# Altium schematic sheet limit_switches.SchDoc: Limit Switches
size A4; Organization: Badgerloop; Address1: 133 Engineering Research; Address2: Building; Address3: Madison, WI 53715; SheetNumber: 19
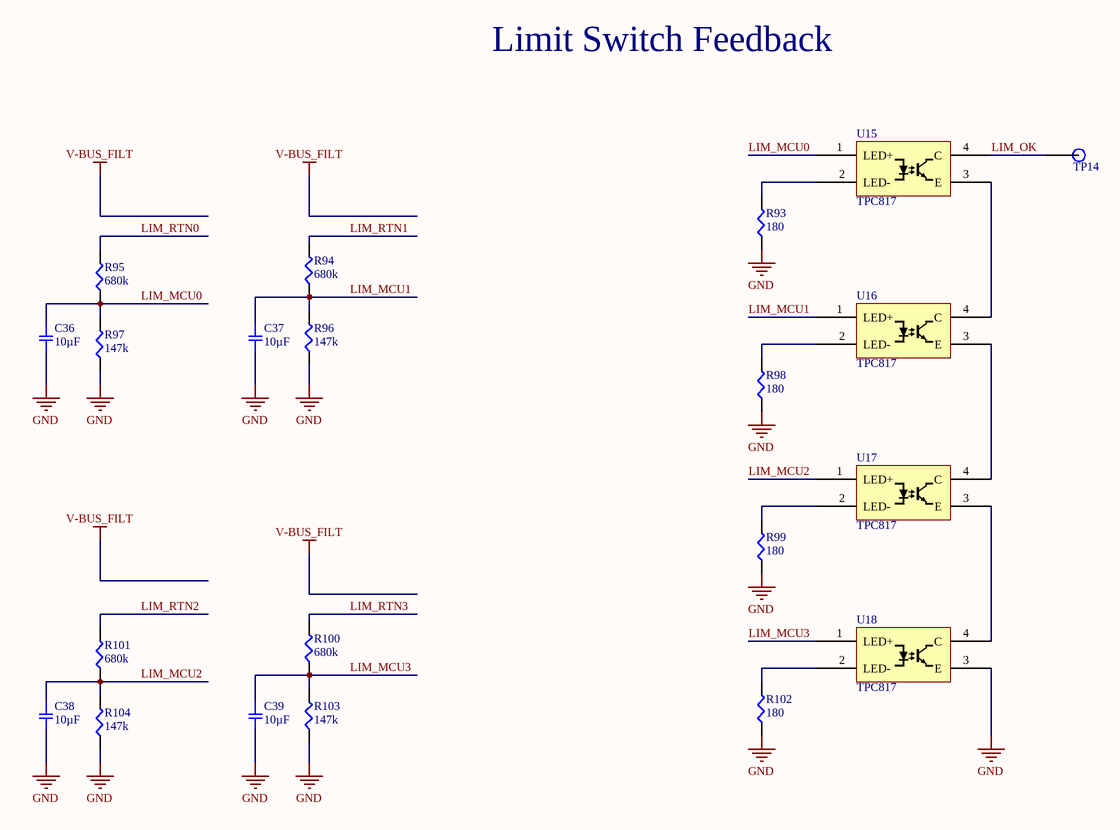
[diagram p0: limit_switches.SchDoc]

## Parts
C36  10µF  [SMD-0805C]
C37  10µF  [SMD-0805C]
C38  10µF  [SMD-0805C]
C39  10µF  [SMD-0805C]
R93  180  [SMD-0805-RES]
R94  680k  [SMD-0805-RES]
R95  680k  [SMD-0805-RES]
R96  147k  [SMD-0805-RES]
R97  147k  [SMD-0805-RES]
R98  180  [SMD-0805-RES]
R99  180  [SMD-0805-RES]
R100  680k  [SMD-0805-RES]
R101  680k  [SMD-0805-RES]
R102  180  [SMD-0805-RES]
R103  147k  [SMD-0805-RES]
R104  147k  [SMD-0805-RES]
TP14  TP  [Test Point]  (value not drawn)
U15  TPC817  [SOT200P1005X328-5N]
U16  TPC817  [SOT200P1005X328-5N]
U17  TPC817  [SOT200P1005X328-5N]
U18  TPC817  [SOT200P1005X328-5N]

## Nets
GND: C36.2 C37.2 C38.2 C39.2 R93.1 R96.1 R97.1 R98.1 R99.1 R102.1 R103.1 R104.1 U18.3(E)
LIM_MCU0: C36.1 R95.1 R97.2 U15.1(LED+)
LIM_MCU1: C37.1 R94.1 R96.2 U16.1(LED+)
LIM_MCU2: C38.1 R101.1 R104.2 U17.1(LED+)
LIM_MCU3: C39.1 R100.1 R103.2 U18.1(LED+)
LIM_OK: TP14.1 U15.4(C)
LIM_RTN0: R95.2
LIM_RTN1: R94.2
LIM_RTN2: R101.2
LIM_RTN3: R100.2
NetR93_2: R93.2 U15.2(LED-)
NetR98_2: R98.2 U16.2(LED-)
NetR99_2: R99.2 U17.2(LED-)
NetR102_2: R102.2 U18.2(LED-)
NetU15_3: U15.3(E) U16.4(C)
NetU16_3: U16.3(E) U17.4(C)
NetU17_3: U17.3(E) U18.4(C)

## Notes on the sheet
- Limit Switch Feedback
- Title
- Size:
- Date:
- A4
- Number:
- Time:
- Revision:
- Sheet
- of
- File:

## Library data of the parts
C36-C39 = GRM21BC81E106KE51L: CAP CER 10UF 25V X6S 0805; Manufacturer: Murata Electronics North America; Factory Stock: 0; Unit Price (USD): 0.25; Minimum Quantity: 1; Tolerance: ±10%; Datasheets: http://www.murata.com/~/media/webrenewal/support/library/catalog/products/capacitor/mlcc/c02e.pdf; Image: //media.digikey.com/Renders/Murata%20Renders/0805%20(2012%20Metric)%20.85mm.jpg; Digi-Key Part Number: 490-10502-1-ND; Part Number: GRM21BC81E106KE51L; Quantity Available: 230; @ qty: 0; Packaging: Cut Tape (CT); Series: GRM; Part Status: Active; Value: 10µF; Voltage: 25V; Temperature Coefficient: X6S; Operating Temperature: -55°C ~ 105°C; Features: Derating Recommended; Ratings: -; Applications: General Purpose; Mounting Type: Surface Mount, MLCC; Package / Case: 0805 (2012 Metric); Size / Dimension: 0.079" L x 0.049" W (2.00mm x 1.25mm); Height - Seated (Max): -; Thickness (Max): 0.055" (1.40mm); Lead Spacing: -; Lead Style: -
R93 R98 R99 R102 = ERJ-6ENF1800V: RES SMD 180 OHM 1% 1/8W 0805; Manufacturer: Panasonic Electronic Components; Factory Stock: 0; Unit Price (USD): 0.00729; @ qty: 1500; Minimum Quantity: 1; Power (Watts): 0.125W, 1/8W; Temperature Coefficient: ±100ppm/°C; Part Number: ERJ-6ENF1800V; Datasheets: http://industrial.panasonic.com/www-cgi/jvcr13pz.cgi?E+PZ+3+AOA0002+ERJ6ENF1800V+7+WW; Image: //media.digikey.com/Renders/Panasonic%20Renders/ERJ-0805%20Pkg.jpg; Digi-Key Part Number: P180CCT-ND; Quantity Available: 33231; Packaging: Cut Tape (CT); Series: ERJ; Part Status: Active; Value: 180; Tolerance: ±1%; Composition: Thick Film; Features: Automotive AEC-Q200; Operating Temperature: -55°C ~ 155°C; Package / Case: 0805 (2012 Metric); Supplier Device Package: 0805; Size / Dimension: 0.079" L x 0.049" W (2.00mm x 1.25mm); Height - Seated (Max): 0.028" (0.70mm); Number of Terminations: 2; Failure Rate: -
R94 R95 R100 R101 = ERJ-6ENF6803V: RES SMD 680K OHM 1% 1/8W 0805; Manufacturer: Panasonic Electronic Components; Factory Stock: 0; Unit Price (USD): 0.00729; @ qty: 1500; Minimum Quantity: 1; Power (Watts): 0.125W, 1/8W; Temperature Coefficient: ±100ppm/°C; Part Number: ERJ-6ENF6803V; Datasheets: http://industrial.panasonic.com/www-cgi/jvcr13pz.cgi?E+PZ+3+AOA0002+ERJ6ENF6803V+7+WW; Image: //media.digikey.com/Renders/Panasonic%20Renders/ERJ-0805%20Pkg.jpg; Digi-Key Part Number: P680KCCT-ND; Quantity Available: 41854; Packaging: Cut Tape (CT); Series: ERJ; Part Status: Active; Value: 680k; Tolerance: ±1%; Composition: Thick Film; Features: Automotive AEC-Q200; Operating Temperature: -55°C ~ 155°C; Package / Case: 0805 (2012 Metric); Supplier Device Package: 0805; Size / Dimension: 0.079" L x 0.049" W (2.00mm x 1.25mm); Height - Seated (Max): 0.028" (0.70mm); Number of Terminations: 2; Failure Rate: -
R96 R97 R103 R104 = ERJ-6ENF1473V: RES SMD 147K OHM 1% 1/8W 0805; Manufacturer: Panasonic Electronic Components; Factory Stock: 0; Unit Price (USD): 0.00729; @ qty: 1500; Minimum Quantity: 1; Power (Watts): 0.125W, 1/8W; Temperature Coefficient: ±100ppm/°C; Part Number: ERJ-6ENF1473V; Datasheets: http://industrial.panasonic.com/www-cgi/jvcr13pz.cgi?E+PZ+3+AOA0002+ERJ6ENF1473V+7+WW; Image: //media.digikey.com/Renders/Panasonic%20Renders/ERJ-0805%20Pkg.jpg; Digi-Key Part Number: P147KCCT-ND; Quantity Available: 10283; Packaging: Cut Tape (CT); Series: ERJ; Part Status: Active; Value: 147k; Tolerance: ±1%; Composition: Thick Film; Features: Automotive AEC-Q200; Operating Temperature: -55°C ~ 155°C; Package / Case: 0805 (2012 Metric); Supplier Device Package: 0805; Size / Dimension: 0.079" L x 0.049" W (2.00mm x 1.25mm); Height - Seated (Max): 0.028" (0.70mm); Number of Terminations: 2; Failure Rate: -
TP14 = TP: SMD TEST POINT
U15-U18 = TPC817: OPTOISO 5KV TRANS 4SOP; Manufacturer: Taiwan Semi; Manufacturer P/N: TPC817S1B RAG; Digikey Link: https://www.digikey.com/product-detail/en/taiwan-semiconductor-corporation/TPC817S1B-RAG/TPC817S1BRAGCT-ND/7359679; Digikey P/N: TPC817S1BRAGCT-ND